# EasyEDA Pro project ESP32_wroom_C.eprj, schematic Motor
Create Date: 2025-08-19; Page Name: P1; Project Name: ESP32_wroom_C; Schematic Name: Motor; Update Date: 2025-08-19; Company: 嘉立创EDA; Page Size: A4; Version: V1.0
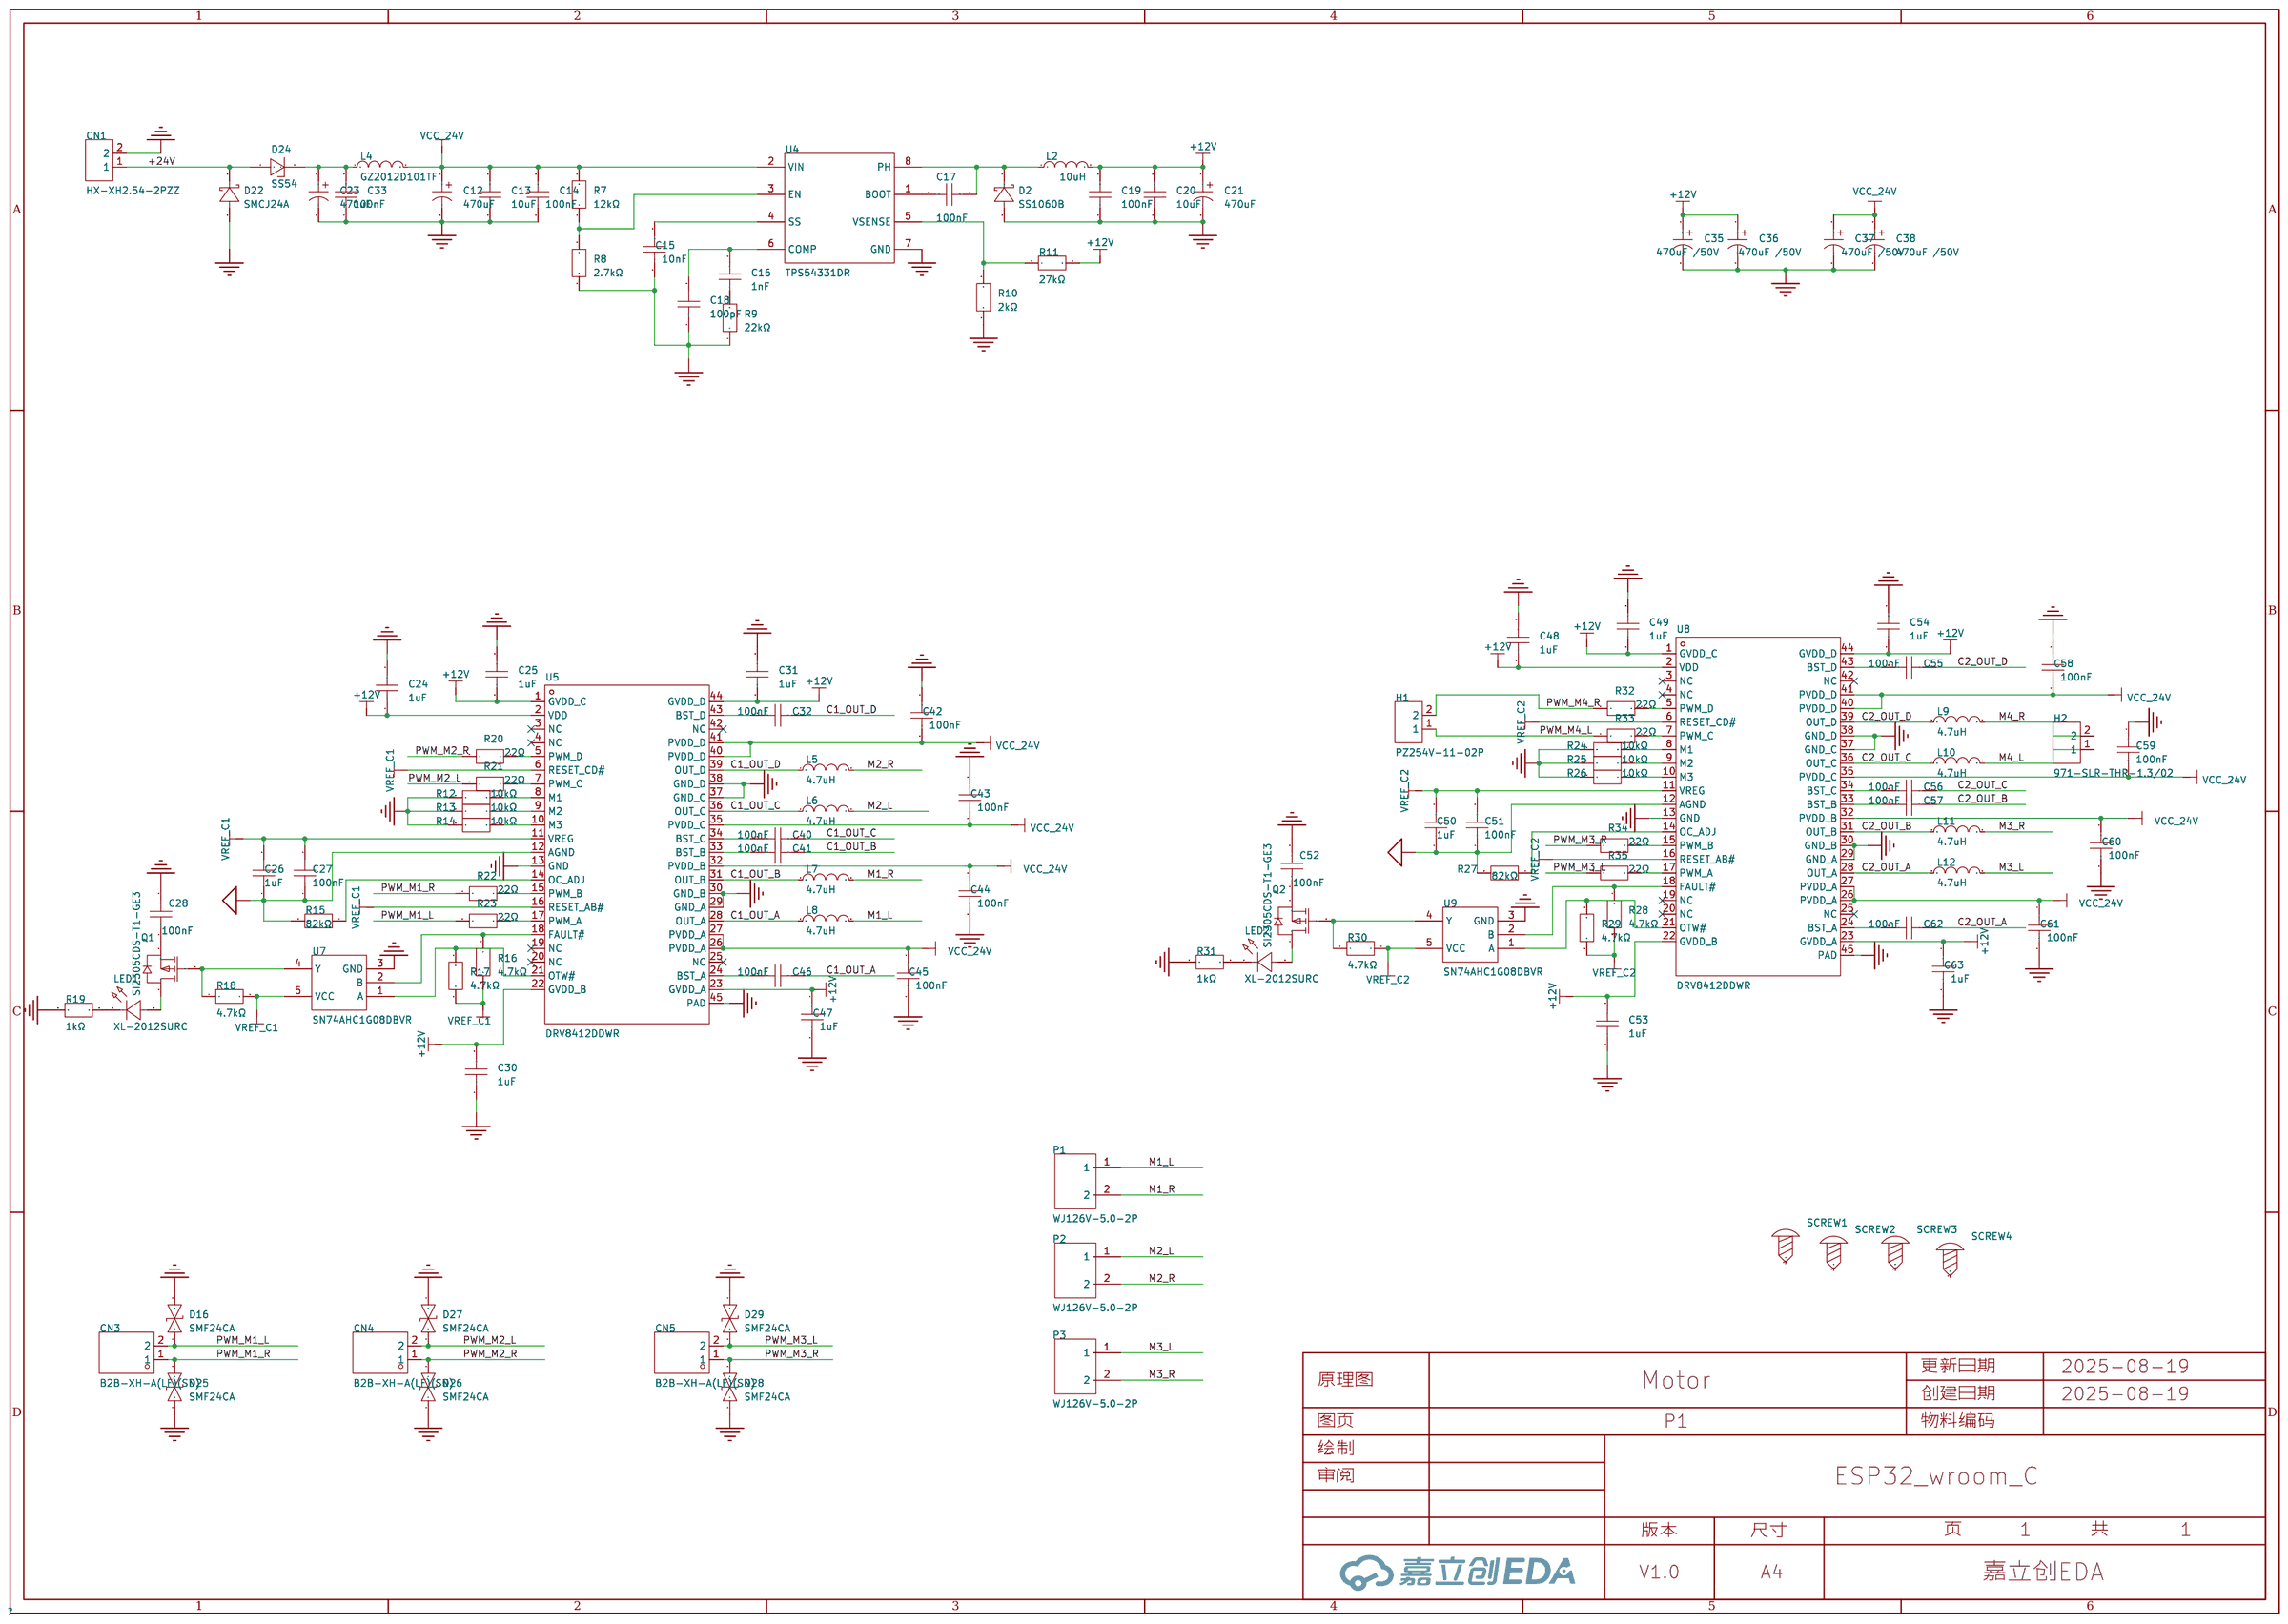
[diagram p0: schematic sheet]

## Parts
C12  470uF  [CAP-TH_BD10.0-P5.00-D0.6-FD-A]
C13  10uF  [C0805]
C14  100nF  [C0603]
C15  10nF  [C0603]
C16  1nF  [C0603]
C17  100nF  [C0603]
C18  100pF  [C0603]
C19  100nF  [C0603]
C20  10uF  [C0805]
C21  470uF  [CAP-TH_BD10.0-P5.00-D0.6-FD-A]
C23  470uF  [CAP-TH_BD10.0-P5.00-D0.6-FD-A]
C24  1uF  [C0805]
C25  1uF  [C0805]
C26  1uF  [C0805]
C27  100nF  [C0805]
C28  100nF  [C0805]
C30  1uF  [C0805]
C31  1uF  [C0805]
C32  100nF  [C0805]
C33  100nF  [C0603]
C35  470uF /50V  [CAP-TH_BD10.0-P5.00-D0.6-FD-A]
C36  470uF /50V  [CAP-TH_BD10.0-P5.00-D0.6-FD-A]
C37  470uF /50V  [CAP-TH_BD10.0-P5.00-D0.6-FD-A]
C38  470uF /50V  [CAP-TH_BD10.0-P5.00-D0.6-FD-A]
C40  100nF  [C0805]
C41  100nF  [C0805]
C42  100nF  [C0805]
C43  100nF  [C0805]
C44  100nF  [C0805]
C45  100nF  [C0805]
C46  100nF  [C0805]
C47  1uF  [C0805]
C48  1uF  [C0805]
C49  1uF  [C0805]
C50  1uF  [C0805]
C51  100nF  [C0805]
C52  100nF  [C0805]
C53  1uF  [C0805]
C54  1uF  [C0805]
C55  100nF  [C0805]
C56  100nF  [C0805]
C57  100nF  [C0805]
C58  100nF  [C0805]
C59  100nF  [C0805]
C60  100nF  [C0805]
C61  100nF  [C0805]
C62  100nF  [C0805]
C63  1uF  [C0805]
CN1  HX-XH2.54-2PZZ  [CONN-TH_2P-P2.50_HX-2.54MM-2P-ZZ-MS]
CN3  B2B-XH-A(LF)(SN)  [CONN-TH_B2B-XH-A-LF-SN]
CN4  B2B-XH-A(LF)(SN)  [CONN-TH_B2B-XH-A-LF-SN]
CN5  B2B-XH-A(LF)(SN)  [CONN-TH_B2B-XH-A-LF-SN]
D2  SS1060B  [SMB_L4.3-W3.6-LS5.3-RD]
D16  SMF24CA  [SOD-123FL_L2.7-W1.8-LS3.8-BI]
D22  SMCJ24A  [SMC_L6.9-W5.9-LS7.9-RD]
D24  SS54  [SMA_L4.3-W2.6-LS5.0-FD]
D25  SMF24CA  [SOD-123FL_L2.7-W1.8-LS3.8-BI]
D26  SMF24CA  [SOD-123FL_L2.7-W1.8-LS3.8-BI]
D27  SMF24CA  [SOD-123FL_L2.7-W1.8-LS3.8-BI]
D28  SMF24CA  [SOD-123FL_L2.7-W1.8-LS3.8-BI]
D29  SMF24CA  [SOD-123FL_L2.7-W1.8-LS3.8-BI]
H1  PZ254V-11-02P  [HDR-TH_2P-P2.54-V-M]
H2  971-SLR-THR-1.3/02  [HDR-TH_2P-P5.00-V-M]
L2  10uH  [IND-SMD_L7.1-W6.6]
L4  GZ2012D101TF  [L0805]
L5  4.7uH  [IND-SMD_L4.0-W4.0]
L6  4.7uH  [IND-SMD_L4.0-W4.0]
L7  4.7uH  [IND-SMD_L4.0-W4.0]
L8  4.7uH  [IND-SMD_L4.0-W4.0]
L9  4.7uH  [IND-SMD_L4.0-W4.0]
L10  4.7uH  [IND-SMD_L4.0-W4.0]
L11  4.7uH  [IND-SMD_L4.0-W4.0]
L12  4.7uH  [IND-SMD_L4.0-W4.0]
LED1  XL-2012SURC  [LED0805-RD_RED]
LED2  XL-2012SURC  [LED0805-RD_RED]
P1  WJ126V-5.0-2P  [CONN-TH_WJ126V-5.0-2P]
P2  WJ126V-5.0-2P  [CONN-TH_WJ126V-5.0-2P]
P3  WJ126V-5.0-2P  [CONN-TH_WJ126V-5.0-2P]
Q1  SI2305CDS-T1-GE3  [SOT-23-3_L2.9-W1.3-P1.90-LS2.4-BR]
Q2  SI2305CDS-T1-GE3  [SOT-23-3_L2.9-W1.3-P1.90-LS2.4-BR]
R7  12kΩ  [R0603]
R8  2.7kΩ  [R0603]
R9  22kΩ  [R0603]
R10  2kΩ  [R0603]
R11  27kΩ  [R0603]
R12  10kΩ  [R0603]
R13  10kΩ  [R0603]
R14  10kΩ  [R0603]
R15  82kΩ  [R0603]
R16  4.7kΩ  [R0603]
R17  4.7kΩ  [R0603]
R18  4.7kΩ  [R0603]
R19  1kΩ  [R0603]
R20  22Ω  [R0603]
R21  22Ω  [R0603]
R22  22Ω  [R0603]
R23  22Ω  [R0603]
R24  10kΩ  [R0603]
R25  10kΩ  [R0603]
R26  10kΩ  [R0603]
R27  82kΩ  [R0603]
R28  4.7kΩ  [R0603]
R29  4.7kΩ  [R0603]
R30  4.7kΩ  [R0603]
R31  1kΩ  [R0603]
R32  22Ω  [R0603]
R33  22Ω  [R0603]
R34  22Ω  [R0603]
R35  22Ω  [R0603]
SCREW1  -  [M3螺丝]
SCREW2  -  [M3螺丝]
SCREW3  -  [M3螺丝]
SCREW4  -  [M3螺丝]
U4  TPS54331DR  [SOIC-8_L5.0-W4.0-P1.27-LS6.0-BL]
U5  DRV8412DDWR  [HTSSOP-44_L14.0-W6.1-P0.64-LS8.1-BL-EP]
U7  SN74AHC1G08DBVR  [SOT-23-5_L3.0-W1.7-P0.95-LS2.8-BR]
U8  DRV8412DDWR  [HTSSOP-44_L14.0-W6.1-P0.64-LS8.1-BL-EP]
U9  SN74AHC1G08DBVR  [SOT-23-5_L3.0-W1.7-P0.95-LS2.8-BR]

## Library data of the parts
C12 C21 C23 C35-C38 = PA50V470M10x17: 容值:470uF;精度:±20%;额定电压:50V;纹波电流:4.1A@100kHz;等效串联电阻(ESR):18mΩ@100kHz;类型:聚合物;; LCSC Part Name: 470uF ±20% 50V; Supplier Part: C46550425; Manufacturer: 捷而瑞; Supplier Footprint: 插件,D10xL17mm; JLCPCB Part Class: 扩展库; Datasheet: https://atta.szlcsc.com/upload/public/pdf/source/20250307/831193F737CAF6D75AC25F14E955F0EC.pdf; Supplier: LCSC; Tolerance: ±20%; Voltage Rating: 50V; Ripple Current: 4.1A@100kHz; Equivalent Series Resistance(ESR): 18mΩ@100kHz; Type: 聚合物; Diameter: 10mm; Height - Seated (Max): 17mm; Lifetime: 2000hrs@105℃; Operating Temperature: -55℃~+105℃
C13 C20 C24-C28 C30-C32 C40-C63 = GRM21BR61H106KE43L: 容值:10uF;精度:±10%;额定电压:50V;材质(温度系数):X5R;; LCSC Part Name: 10uF ±10% 50V; Supplier Part: C440198; Manufacturer: muRata(村田); Supplier Footprint: 0805; JLCPCB Part Class: 基础库; Datasheet: https://atta.szlcsc.com/upload/public/pdf/source/20230811/95AAE0C9AF55EDC31B7A4D8B733F534E.pdf; Supplier: LCSC; Tolerance: ±10%; Voltage Rated: 50V; Temperature Coefficient: X5R
C14-C19 C33 = CGA0603X7R104K500JT: 容值:100nF;精度:±10%;额定电压:50V;温度系数:X7R;; LCSC Part Name: 100nF ±10% 50V; Supplier Part: C6119867; Manufacturer: HRE(芯声); Supplier Footprint: 0603; JLCPCB Part Class: 扩展库; Datasheet: https://atta.szlcsc.com/upload/public/pdf/source/20250103/C44077DA9E7B3EFAE02F22B6D3D1CBC9.pdf; Supplier: LCSC; Tolerance: ±10%; Voltage Rating: 50V; Temperature Coefficient: X7R
CN1 = HX-XH2.54-2PZZ: 插针结构:1x2P;间距:2.54mm;安装方式:直插;参考系列:XH;总PIN数:2P;排数:1;每排PIN数:2;行距:-;额定电流:3A;触头材质:黄铜;触头镀层:锡;工作温度:-25℃~+85℃;; LCSC Part Name: 1x2P 间距:2.5mm 直插 系列:XH; Supplier Part: C42391660; Manufacturer: hanxia(韩下); Supplier Footprint: 插件,P=2.5mm; JLCPCB Part Class: 扩展库; Datasheet: https://atta.szlcsc.com/upload/public/pdf/source/20250424/6595AFD46F48EB1769CC371B34ADCF57.pdf; Supplier: LCSC; Pins Structure: 1x2P; Pitch: 2.54mm; Mounting Type: 直插; Reference Series: XH; Number of Pins: 2P; Number of Rows: 1; Number of PINs Per Row: 2; Current Rating: 3A; Contact Material: 黄铜; Contact Plating: 锡; Operating Temperature: -25℃~+85℃; Voltage Rating: 250V; Plastic Material: PA66; Flame Retardant Rating: UL94V-0; Color: 白色
CN3-CN5 = B2B-XH-A(LF)(SN): 插针结构:1x2P;间距:2.5mm;安装方式:直插;参考系列:XH;总PIN数:2P;排数:1;每排PIN数:2;行距:-;额定电流:3A;触头材质:黄铜;触头镀层:锡;工作温度:-25℃~+85℃;; LCSC Part Name: 1x2P 间距:2.5mm 直插 系列:XH; Supplier Part: C158012; Manufacturer: JST; Supplier Footprint: 插件,P=2.5mm; JLCPCB Part Class: 扩展库; Datasheet: https://item.szlcsc.com/datasheet/B2B-XH-A(LF)(SN)/169360.html; Supplier: LCSC; Pins Structure: 1x2P; Pitch: 2.5mm; Mounting Type: 直插; Reference Series: XH; Number of Pins: 2P; Number of Rows: 1; Number of PINs Per Row: 2; Current Rating: 3A; Contact Material: 黄铜; Contact Plating: 锡; Operating Temperature: -25℃~+85℃; Voltage Rating: 250V; Plastic Material: PA66; Flame Retardant Rating: UL94V-0; Supplementary Features: 打K脚; Color: 白色; Z-Height of the Board: 7mm; X-Length of Bottom Edge on Board (Spacing Line): 7.4mm; Y-Width of Bottom Edge on Board: 5.75mm
D2 = SS1060B_C18208635: 正向压降(Vf):700mV@10A;直流反向耐压(Vr):60V;整流电流:10A;; LCSC Part Name: 电压:60V 电流:10A; Supplier Part: C18208635; Manufacturer: Slkor(萨科微); Supplier Footprint: SMB; JLCPCB Part Class: 扩展库; Datasheet: https://item.szlcsc.com/datasheet/SS1060B/19373155.html; Supplier: LCSC; Voltage - Forward(Vf@If): 700mV@10A; Voltage - DC Reverse(Vr): 60V; Current - Rectified: 10A; Reverse Leakage Current (Ir): 100nA@60V; Operating Junction Temperature Range: -55℃~+150℃
D16 D25-D29 = SMF24CA_C19077515: 极性:双向;反向截止电压(Vrwm):24V;最大钳位电压:38.9V;峰值脉冲电流(Ipp)@10/1000us:5.1A;峰值脉冲功率(Ppp)@10/1000us:200W;击穿电压:29.5V;; Supplier Part: C19077515; Manufacturer: 宏迦橙; Supplier Footprint: SOD-123FL; JLCPCB Part Class: 扩展库; Datasheet: https://atta.szlcsc.com/upload/public/pdf/source/20231129/4813F17DC56F8B344A8D004597B3633C.pdf; Supplier: LCSC; polarity: 双向; Reverse Stand-Off Voltage (Vrwm): 24V; Maximum Clamping Voltage: 38.9V; Peak Pulse Current (Ipp)@10/1000us: 5.1A; Peak Pulse Power Dissipation (Ppp)@10/1000us: 200W; Breakdown Voltage: 29.5V; Reverse Leakage Current (Ir): 1uA; Operating Temperature: -55℃~+155℃; Type: TVS
D22 = SMCJ24A_C19077604: 极性:单向;反向截止电压(Vrwm):24V;钳位电压:38.9V;峰值脉冲电流(Ipp):38.6A@10/1000us;峰值脉冲功率(Ppp):1.5kW@10/1000us;击穿电压:29.5V;; Supplier Part: C19077604; Manufacturer: 宏嘉诚; Supplier Footprint: SMC; JLCPCB Part Class: 扩展库; Datasheet: https://item.szlcsc.com/datasheet/SMCJ24A/20275689.html; Supplier: LCSC; Polarity: 单向; Reverse Stand-Off Voltage (Vrwm): 24V; Clamping Voltage: 38.9V; Peak Pulse Current (Ipp): 38.6A@10/1000us; Peak Pulse Power Dissipation (Ppp): 1.5kW@10/1000us; Voltage - Breakdown: 29.5V; Reverse Leakage Current (Ir): 1uA; Operating Temperature: -55℃~+150℃; level of protection: IEC 61000-4-2; Type: TVS
D24 = SS54_C7420369: 二极管配置:独立式;正向压降(Vf):550mV@5.0A;直流反向耐压(Vr):40V;整流电流:5A;; LCSC Part Name: 电压:40V 电流:5A; Supplier Part: C7420369; Manufacturer: 宏嘉诚; Supplier Footprint: SMA(DO-214AC); JLCPCB Part Class: 扩展库; Datasheet: https://item.szlcsc.com/datasheet/SS54/8397191.html; Supplier: LCSC; Diode Configuration: 独立式; Voltage - Forward(Vf@If): 550mV@5.0A; Voltage - DC Reverse(Vr): 40V; Current - Rectified: 5A; Reverse Leakage Current (Ir): 50uA@40V; Operating Junction Temperature Range: -55℃~+125℃; Non-Repetitive Peak Forward Surge Current: 120A
H1 = PZ254V-11-02P: 插针结构:1x2P;间距:2.54mm;行距:-;圆针/方针:方针;安装方式:直插;排数:单排;总PIN位数:2P;额定电流:-;额定电压:-;配合针长度:6mm;塑高:2.5mm;端接针长度:3mm;触头材质:黄铜;触头镀层:-;工作温度:-40℃~+105℃;颜色:黑色;; LCSC Part Name: 1x2P 间距:2.54mm 方针 直插; Supplier Part: C492401; Manufacturer: XFCN(兴飞); Supplier Footprint: 插件,P=2.54mm; JLCPCB Part Class: 扩展库; Datasheet: https://atta.szlcsc.com/upload/public/pdf/source/20200309/C492401_A812433581A9B211A7FFA413ADDFF0E5.pdf; Supplier: LCSC; Pin Structure: 1x2P; Pitch: 2.54mm; Circluar Pins/Square Pins: 方针; Mounting Type: 直插; Number of Rows: 单排; Number of Pins: 2P; Length of Mating Pin: 6mm; Insulation Height: 2.5mm; Length of End Connection Pin: 3mm; Contact Material: 黄铜; Operating Temperature: -40℃~+105℃; Color: 黑色
H2 = 971-SLR-THR-1.3/02: 插针结构:1x2P;间距:5mm;圆针/方针:圆针;安装方式:直插;排数:单排;总PIN位数:2P;额定电流:10A;额定电压:250V;触头材质:黄铜;触头镀层:锡;工作温度:-40℃~+120℃;颜色:黑色;; LCSC Part Name: 1x2P 间距:5mm 圆针 直插; Supplier Part: C22358779; Manufacturer: WECO(威克德诺); Supplier Footprint: 插件P=5mm; JLCPCB Part Class: 扩展库; Datasheet: https://atta.szlcsc.com/upload/public/pdf/source/20230712/75CCE54300B248B45D0113E46E19DD61.pdf; Supplier: LCSC; Pin Structure: 1x2P; Pitch: 5mm; Circluar Pins/Square Pins: 圆针; Mounting Type: 直插; Number of Rows: 单排; Number of Pins: 2P; Current Rating: 10A; Voltage Rating (Max): 250V; Contact Material: 黄铜; Contact Plating: 锡; Operating Temperature: -40℃~+120℃; Color: 黑色
L2 = D0630HP-100MT: 电感值:10uH;精度:±20%;饱和电流(Isat):4.5A;类型:一体成型电感;; LCSC Part Name: 一体成型电感 0630-10UH 10uH ±20%; Supplier Part: C41410464; Manufacturer: DEYAN(德砚电子); Supplier Footprint: SMD,7.1x6.6mm; JLCPCB Part Class: 扩展库; Datasheet: https://item.szlcsc.com/datasheet/D0630HP-100MT/43219172.html; Supplier: LCSC; Tolerance: ±20%; Current - Saturation(Isat): 4.5A; DC Resistance(DCR): 68mΩ; Type: 一体成型电感
L4 = GZ2012D101TF: 阻抗@频率:100Ω@100MHz;误差:±25%;直流电阻(DCR):150mΩ;; LCSC Part Name: 单路 0805磁珠 阻抗100Ω@100MHz; Supplier Part: C1015; Manufacturer: Sunlord(顺络); Supplier Footprint: 0805; JLCPCB Part Class: 基础库; Datasheet: https://atta.szlcsc.com/upload/public/pdf/source/20241120/893429B990C3BA07384E734821D2F218.pdf; Supplier: LCSC; Impedance @ Frequency: 100Ω@100MHz; Tolerance: ±25%; DC Resistance(DCR): 150mΩ; Current Rating: 800mA; Number of Circuits: 1
L5-L12 = SWPA4030S4R7MT: 电感值:4.7uH;精度:±20%;额定电流:2A;饱和电流(Isat):3.2A;类型:-;; LCSC Part Name: 4.7uH ±20% 3.2A; Supplier Part: C57269; Manufacturer: Sunlord(顺络); Supplier Footprint: SMD,4x4mm; JLCPCB Part Class: 扩展库; Datasheet: https://atta.szlcsc.com/upload/public/pdf/source/20231024/317626D2AA2F8AB4113C1875E432E6E1.pdf; Supplier: LCSC; Tolerance: ±20%; Rated Current: 2A; Current - Saturation(Isat): 3.2A; DC Resistance(DCR): 78mΩ
LED1 LED2 = XL-2012SURC: 发光颜色:红色;功率:55mW;正向电流:25mA;主波长:617nm~621nm;透镜颜色:无色透明透镜;色温:-;发光角度:120°;载带方式:正贴;工作温度:-30℃~+85℃;; Supplier Part: C965812; Manufacturer: XINGLIGHT(成兴光); Supplier Footprint: 0805; JLCPCB Part Class: 扩展库; Datasheet: https://atta.szlcsc.com/upload/public/pdf/source/20221102/49E1A0A365644091E6270AF1C5E0FE37.pdf; Supplier: LCSC; Emitted Color: 红色; Power Dissipation: 55mW; Forward Current: 25mA; Dominant Wavelength: 617nm~621nm; Peak Wavelength: 623nm; Lens Color: 无色透明透镜; Viewing Angle: 120°; Mounting Sytle: 正贴; Operating Temperature: -30℃~+85℃
P1-P3 = WJ126V-5.0-2P: 结构:1x2P;间距:5mm;颜色:绿色;安装方式:直插;额定电流:18A;额定电压:250V;排数:1;线规 - AWG:14~26;线规 - 平方毫米:2.5;每排PIN数:2;工作温度范围:-40℃~+105℃;; LCSC Part Name: 5mm 1x2P 排数:1 每排P数:2 直插; Supplier Part: C8404; Manufacturer: KANGNEX(康奈克斯电气); Supplier Footprint: 插件,P=5mm; JLCPCB Part Class: 扩展库; Datasheet: https://atta.szlcsc.com/upload/public/pdf/source/20191225/C8404_8F52D87DF851D149A4DEA9BD9FA83F9A.pdf; Supplier: LCSC; Structure: 1x2P; Pitch: 5mm; Color: 绿色; Mounting Style: 直插; Current Rating (Max): 18A; Voltage Rating (Max): 250V; Number of Pins: 2P; Number of Rows: 1; Wire Gauge - AWG: 14~26; Wire Gauge - mm2: 2.5; Number of PINs Per Row: 2; Operating Temperature Range: -40℃~+105℃
Q1 Q2 = SI2305CDS-T1-GE3: 类型:1个P沟道;漏源电压(Vdss):8V;连续漏极电流(Id):4.4A;导通电阻(RDS(on)@Vgs,Id):65mΩ@1.8V,2A;功率(Pd):1.1W;阈值电压(Vgs(th)@Id):1V@250uA;; LCSC Part Name: 1个P沟道 耐压:8V 电流:4.4A; Supplier Part: C37577; Manufacturer: VISHAY(威世); Supplier Footprint: SOT-23; JLCPCB Part Class: 扩展库; Datasheet: https://atta.szlcsc.com/upload/public/pdf/source/20150319/1457707265783.pdf; Supplier: LCSC; Type: 1个P沟道; Drain Source Voltage (Vdss): 8V; Continuous Drain Current (Id): 4.4A; Drain Source On Resistance (RDS(on)@Vgs,Id): 65mΩ@1.8V,2A; Power Dissipation (Pd): 1.1W; Gate Threshold Voltage (Vgs(th)@Id): 1V@250uA; Total Gate Charge (Qg@Vgs): 12nC@4V; Input Capacitance (Ciss@Vds): 960pF@4V; Reverse Transfer Capacitance (Crss@Vds): 300pF@4V; Operating Temperature: -55℃~+150℃
R7-R35 = FRC0603J123 TS: 电阻类型:厚膜电阻;阻值:12kΩ;精度:±5%;功率:100mW;工作电压:75V;温度系数:±100ppm/℃;; LCSC Part Name: 12kΩ ±5% 100mW 厚膜电阻; Supplier Part: C2907097; Manufacturer: FOJAN(富捷); Supplier Footprint: 0603; JLCPCB Part Class: 扩展库; Datasheet: https://item.szlcsc.com/datasheet/FRC0603J123%2520TS/3180610.html; Supplier: LCSC; Type: 厚膜电阻; Tolerance: ±5%; Power(Watts): 100mW; Voltage-Supply(Max): 75V; Temperature Coefficient: ±100ppm/℃; Operating Temperature: -55℃~+155℃
SCREW1-SCREW4 = M3螺丝: Supplier Footprint: 插件
U4 = TPS54331DR: 功能类型:降压型;输出类型:可调;工作电压:3.5V~28V;输出电压:-;输出电流:3A;; LCSC Part Name: 3A, 28V 输入非同步降压转换器; Supplier Part: C9865; Manufacturer: TI(德州仪器); Supplier Footprint: SOIC-8; JLCPCB Part Class: 扩展库; Datasheet: https://www.ti.com/cn/lit/gpn/tps54331; Supplier: LCSC; Function: 降压型; Output Type: 可调; Input Voltage: 3.5V~28V; Output Current: 3A; Switching Frequency: 570kHz; Operating Temperature: -40℃~+150℃@(TJ); Synchronous Rectification: 否; Number of Outputs: 1; Topology: 降压式; Quiescent Current (Iq): 1mA; Switch tube (built-in/external): 内置
U5 U8 = DRV8412DDWR: DRV8412 70V、6A 双通道 H 桥电机驱动器; LCSC Part Name: 13.2V电机驱动芯片; Supplier Part: C79852; Manufacturer: TI(德州仪器); Supplier Footprint: HTSSOP-44-EP-6.1mm; JLCPCB Part Class: 扩展库; Datasheet: https://www.ti.com/cn/lit/gpn/drv8412; Supplier: LCSC
U7 U9 = SN74AHC1G08DBVR: 逻辑类型:与门;通道数:1;工作电压:2V~5.5V;静态电流(Iq):1uA;传播延迟(tpd):7.9ns@5V,50pF;; Supplier Part: C7467; Manufacturer: TI(德州仪器); Supplier Footprint: SOT-23-5; JLCPCB Part Class: 扩展库; Datasheet: https://www.ti.com/cn/lit/gpn/sn74ahc1g08; Supplier: LCSC; Logic Type: 与门; Number of Channels: 1; Voltage - Supply: 2V~5.5V; Quiescent Current: 1uA; Current - Output Low(IOL): 8mA; Current - Output High(IOH): 8mA; Input Logic Level - High: 1.5V~3.85V; Input Logic Level - Low: 500mV~1.65V; Series: 74AHC系列; Propagation Delay: 7.9ns@5V,50pF; Operating Temperature: -55℃~+125℃

## Nets
+12V: C19.2 C20.2 C21.1 C24.1 C25.1 C30.2 C31.1 C35.1 C36.1 C47.1 C48.1 C49.1 C53.2 C54.1 C63.1 L2.2 R11.2 U5.1(GVDD_C) U5.2(VDD) U5.22(GVDD_B) U5.23(GVDD_A) U5.44(GVDD_D) U8.1(GVDD_C) U8.2(VDD) U8.22(GVDD_B) U8.23(GVDD_A) U8.44(GVDD_D)
+24V: CN1.1 D22.1(-) D24.1(A)
AGND_C1: C26.1 C27.1 R15.2 U5.12(AGND)
AGND_C2: C50.1 C51.1 R27.2 U8.12(AGND)
GND: C12.2 C13.1 C14.1 C15.1 C18.1 C19.1 C20.1 C21.2 C23.2 C24.2 C25.2 C28.2 C30.1 C31.2 C33.1 C35.2 C36.2 C37.2 C38.2 C42.1 C43.1 C44.2 C45.2 C47.2 C48.2 C49.2 C52.2 C53.1 C54.2 C58.1 C59.1 C60.2 C61.2 C63.2 CN1.2 D2.2(A) D16.2(A) D22.2(+) D25.1(K) D26.1(K) D27.1(K) D28.1(K) D29.1(K) R8.1 R9.1 R10.1 R12.2 R13.2 R14.2 R19.1 R24.2 R25.2 R26.2 R31.1 U4.7(GND) U5.13(GND) U5.29(GND_A) U5.30(GND_B) U5.37(GND_C) U5.38(GND_D) U5.45(PAD) U7.3(GND) U8.13(GND) U8.29(GND_A) U8.30(GND_B) U8.37(GND_C) U8.38(GND_D) U8.45(PAD) U9.3(GND)
VCC_24V: C12.1 C13.2 C14.2 C37.1 C38.1 C42.2 C43.2 C44.1 C45.1 C58.2 C59.2 C60.1 C61.1 L4.2 R7.2 U4.2(VIN) U5.26(PVDD_A) U5.27(PVDD_A) U5.32(PVDD_B) U5.35(PVDD_C) U5.40(PVDD_D) U5.41(PVDD_D) U8.26(PVDD_A) U8.27(PVDD_A) U8.32(PVDD_B) U8.35(PVDD_C) U8.40(PVDD_D) U8.41(PVDD_D)
C1_OUT_A: C46.1 L8.1 U5.28(OUT_A)
C1_OUT_B: C41.1 L7.1 U5.31(OUT_B)
C1_OUT_C: C40.1 L6.1 U5.36(OUT_C)
C1_OUT_D: C32.1 L5.1 U5.39(OUT_D)
C2_OUT_A: C62.1 L12.1 U8.28(OUT_A)
C2_OUT_B: C57.1 L11.1 U8.31(OUT_B)
C2_OUT_C: C56.1 L10.1 U8.36(OUT_C)
C2_OUT_D: C55.1 L9.1 U8.39(OUT_D)
M1_L: L8.2 P1.1
M1_R: L7.2 P1.2
M2_L: L6.2 P2.1
M2_R: L5.2 P2.2
M3_L: L12.2 P3.1
M3_R: L11.2 P3.2
M4_L: H2.1 L10.2
M4_R: H2.2 L9.2
PWM_M1_L: CN3.2 D16.1(K) R23.2
PWM_M1_R: CN3.1 D25.2(A) R22.2
PWM_M2_L: CN4.2 D27.2(A) R21.2
PWM_M2_R: CN4.1 D26.2(A) R20.2
PWM_M3_L: CN5.2 D29.2(A) R35.2
PWM_M3_R: CN5.1 D28.2(A) R34.2
PWM_M4_L: H1.1 R33.2
PWM_M4_R: H1.2 R32.2
VREF_C1: C26.2 C27.2 R16.2 R17.2 R18.2 U5.6(RESET_CD#) U5.11(VREG) U5.16(RESET_AB#) U7.5(VCC)
VREF_C2: C50.2 C51.2 R28.2 R29.2 R30.2 U8.6(RESET_CD#) U8.11(VREG) U8.16(RESET_AB#) U9.5(VCC)
$1N1956: R7.1 R8.2 U4.3(EN)
$1N1957: C15.2 U4.4(SS)
$1N1958: C17.1 U4.1(BOOT)
$1N1959: C17.2 D2.1(C) L2.1 U4.8(PH)
$1N1961: C16.1 R9.2
$1N1962: C16.2 C18.2 U4.6(COMP)
$1N1963: R10.2 R11.1 U4.5(VSENSE)
$1N1974: C23.1 C33.2 D24.2(K) L4.1
$1N3477: R12.1 U5.8(M1)
$1N3483: R13.1 U5.9(M2)
$1N3486: R14.1 U5.10(M3)
$1N3753: R15.1 U5.14(OC_ADJ)
$1N4158: R16.1 U5.18(FAULT#) U7.2(B)
$1N4251: Q1.1(G) R18.1 U7.4(Y)
$1N4373: C28.1 Q1.2(S)
$1N4506: LED1.1(K) R19.2
$1N4523: LED1.2(A) Q1.3(D)
$1N4719: C32.2 U5.43(BST_D)
$1N5477: C40.2 U5.34(BST_C)
$1N5516: C41.2 U5.33(BST_B)
$1N6029: C46.2 U5.24(BST_A)
$1N6164: R20.1 U5.5(PWM_D)
$1N6209: R21.1 U5.7(PWM_C)
$1N6262: R22.1 U5.15(PWM_B)
$1N6307: R23.1 U5.17(PWM_A)
$1N8050: R24.1 U8.8(M1)
$1N8052: R25.1 U8.9(M2)
$1N8054: R26.1 U8.10(M3)
$1N8077: R27.1 U8.14(OC_ADJ)
$1N8087: R28.1 U8.18(FAULT#) U9.2(B)
$1N8092: R29.1 U8.21(OTW#) U9.1(A)
$1N8102: Q2.1(G) R30.1 U9.4(Y)
$1N8105: C52.1 Q2.2(S)
$1N8109: LED2.1(K) R31.2
$1N8113: LED2.2(A) Q2.3(D)
$1N8127: C55.2 U8.43(BST_D)
$1N8152: C56.2 U8.34(BST_C)
$1N8157: C57.2 U8.33(BST_B)
$1N8198: C62.2 U8.24(BST_A)
$1N8212: R32.1 U8.5(PWM_D)
$1N8217: R33.1 U8.7(PWM_C)
$1N8222: R34.1 U8.15(PWM_B)
$1N8227: R35.1 U8.17(PWM_A)
$1N8570: R17.1 U5.21(OTW#) U7.1(A)

Not connected (* = marked no-connect by the designer): SCREW1 1; SCREW2 1; SCREW3 1; SCREW4 1; U5 3(NC)* 4(NC)* 19(NC)* 20(NC)* 25(NC)* 42(NC)*; U8 3(NC)* 4(NC)* 19(NC)* 20(NC)* 25(NC)* 42(NC)*
